# EAGLE schematic USB Experiment Board (EAGLE 7.2.0)
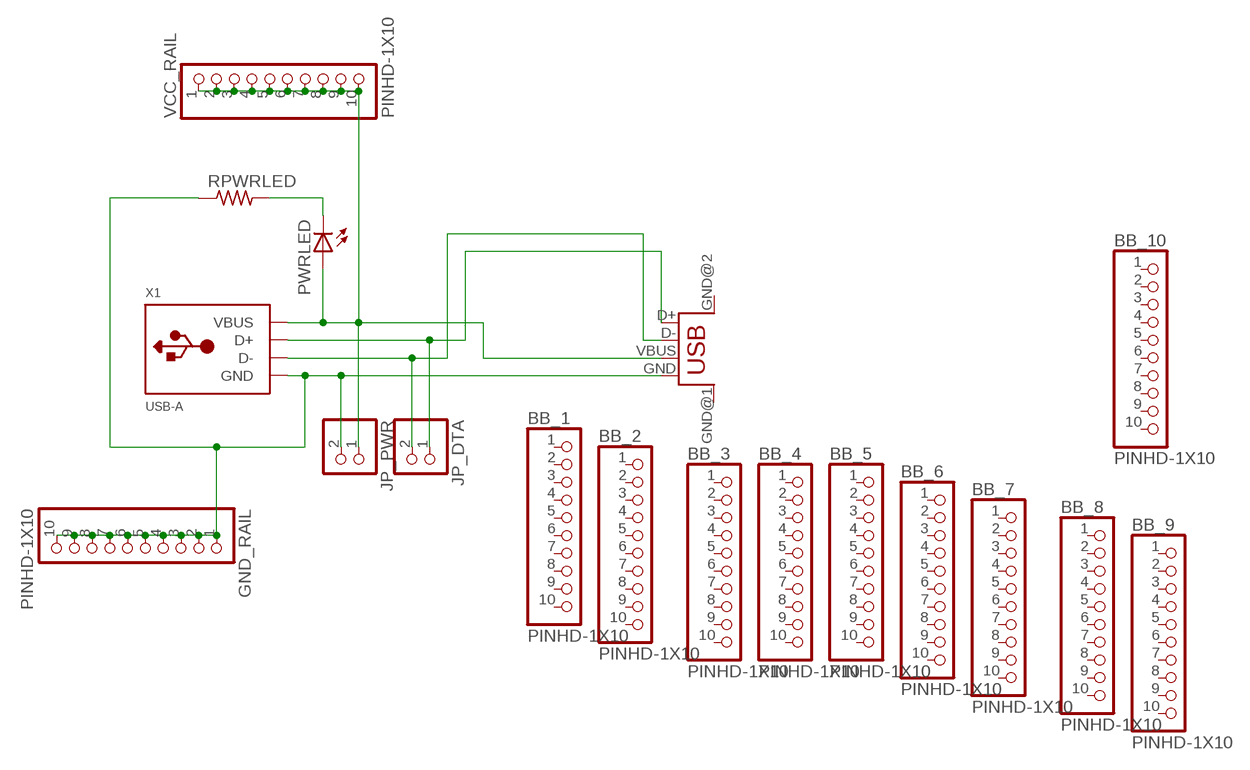
[diagram p0: schematic, sheet 1]

## Parts
BB_1  PINHD-1X10  [1X10-BIG]
BB_2  PINHD-1X10  [1X10-BIG]
BB_3  PINHD-1X10  [1X10-BIG]
BB_4  PINHD-1X10  [1X10-BIG]
BB_5  PINHD-1X10  [1X10-BIG]
BB_6  PINHD-1X10  [1X10-BIG]
BB_7  PINHD-1X10  [1X10-BIG]
BB_8  PINHD-1X10  [1X10-BIG]
BB_9  PINHD-1X10  [1X10-BIG]
BB_10  PINHD-1X10  [1X10-BIG]
GND_RAIL  PINHD-1X10  [1X10-BIG]
JP_DTA  PINHD-1X2  [1X02]
JP_PWR  PINHD-1X2  [1X02]
PWRLED  LEDCHIPLED_0805  [CHIPLED_0805]
RPWRLED  R-US_R0805  [R0805]
U$1  USB  [USB-FEMALE-A-PTH]
VCC_RAIL  PINHD-1X10  [1X10-BIG]
X1  USB-A  [MOLEX_480371000]

## Nets
N$1: GND_RAIL.1 GND_RAIL.2 GND_RAIL.3 GND_RAIL.4 GND_RAIL.5 GND_RAIL.6 GND_RAIL.7 GND_RAIL.8 GND_RAIL.9 GND_RAIL.10 JP_PWR.2 RPWRLED.1 U$1.GND X1.4(GND)
N$3: JP_DTA.1 U$1.D+ X1.3(D+)
N$4: JP_DTA.2 U$1.D- X1.2(D-)
N$5: JP_PWR.1 PWRLED.A U$1.VBUS VCC_RAIL.1 VCC_RAIL.2 VCC_RAIL.3 VCC_RAIL.4 VCC_RAIL.5 VCC_RAIL.6 VCC_RAIL.7 VCC_RAIL.8 VCC_RAIL.9 VCC_RAIL.10 X1.1(VBUS)
N$6: PWRLED.C RPWRLED.2
Unconnected: BB_1.1 BB_1.2 BB_1.3 BB_1.4 BB_1.5 BB_1.6 BB_1.7 BB_1.8 BB_1.9 BB_1.10 BB_2.1 BB_2.2 BB_2.3 BB_2.4 BB_2.5 BB_2.6 BB_2.7 BB_2.8 BB_2.9 BB_2.10 BB_3.1 BB_3.2 BB_3.3 BB_3.4 BB_3.5 BB_3.6 BB_3.7 BB_3.8 BB_3.9 BB_3.10 BB_4.1 BB_4.2 BB_4.3 BB_4.4 BB_4.5 BB_4.6 BB_4.7 BB_4.8 BB_4.9 BB_4.10 BB_5.1 BB_5.2 BB_5.3 BB_5.4 BB_5.5 BB_5.6 BB_5.7 BB_5.8 BB_5.9 BB_5.10 BB_6.1 BB_6.2 BB_6.3 BB_6.4 BB_6.5 BB_6.6 BB_6.7 BB_6.8 BB_6.9 BB_6.10 BB_7.1 BB_7.2 BB_7.3 BB_7.4 BB_7.5 BB_7.6 BB_7.7 BB_7.8 BB_7.9 BB_7.10 BB_8.1 BB_8.2 BB_8.3 BB_8.4 BB_8.5 BB_8.6 BB_8.7 BB_8.8 BB_8.9 BB_8.10 BB_9.1 BB_9.2 BB_9.3 BB_9.4 BB_9.5 BB_9.6 BB_9.7 BB_9.8 BB_9.9 BB_9.10 BB_10.1 BB_10.2 BB_10.3 BB_10.4 BB_10.5 BB_10.6 BB_10.7 BB_10.8 BB_10.9 BB_10.10 U$1.GND@1(GND) U$1.GND@2(GND)

## Library data of the parts
BB_1-BB_10 GND_RAIL VCC_RAIL = adafruit:PINHD-1X10: Pin header 1x10 0.1" spacing With round pins
JP_DTA JP_PWR = pinhead:PINHD-1X2: PIN HEADER
PWRLED = adafruit:LED: LED OSRAM: - CHIPLED LG R971, LG N971, LY N971, LG Q971, LY Q971, LO R971, LY R971 LH N974, LH R974 LS Q976, LO Q976, LY Q976 LO Q996 - Hyper CHIPLED LW Q18S LB Q993, LB Q99A, LB R99A - SideLED LS A670, LO A670, LY A670, LG A670, LP A670 LB A673, LV A673, LT A673, LW A673 LH A674 LY A675 LS A676, LA A676, LO A676, LY A676, LW A676 LS A679, LY A679, LG A679 - Hyper Micro SIDELED® LS Y876, LA Y876, LO Y876, LY Y876 LT Y87S - SmartLED LW L88C, LW L88S LB L89C, LB L89S, LG L890 LS L89K, LO L89K, LY L89K LS L896, LA L896, LO L896, LY L896 - TOPLED LS T670, LO T670, LY T670, LG T670, LP T670 LSG T670, LSP T670, LSY T670, LOP T670, LYG T670 LG T671, LOG T671, LSG T671 LB T673, LV T673, LT T673, LW T673 LH T674 LS T676, LA T676, LO T676, LY T676, LB T676, LH T676, LSB T676, LW T676 LB T67C, LV T67C, LT T67C, LS T67K, LO T67K, LY T67K, LW E67C LS E67B, LA E67B, LO E67B, LY E67B, LB E67C, LV E67C, LT E67C LW T67C LS T679, LY T679, LG T679 LS T770, LO T770, LY T770, LG T770, LP T770 LB T773, LV T773, LT T773, LW T773 LH T774 LS E675, LA E675, LY E675, LS T675 LS T776, LA T776, LO T776, LY T776, LB T776 LHGB T686 LT T68C, LB T68C - Hyper Mini TOPLED® LB M676 - Mini TOPLED Santana® LG M470 LS M47K, LO M47K, LY M47K Source: http://www.osram.convergy.de/
RPWRLED = adafruit:R-US_: RESISTOR, American symbol
U$1 = STUNTAZ:USB: USB Connectors USB-FEMALE-A-PTH: Through hole Female Type A Connector
X1 = adafruit:USB-A: USB type A 'plug' Used for things that can directly connect to a USB port, say USB key